# Altium schematic sheet FXAS21002C.SchDoc
size A4
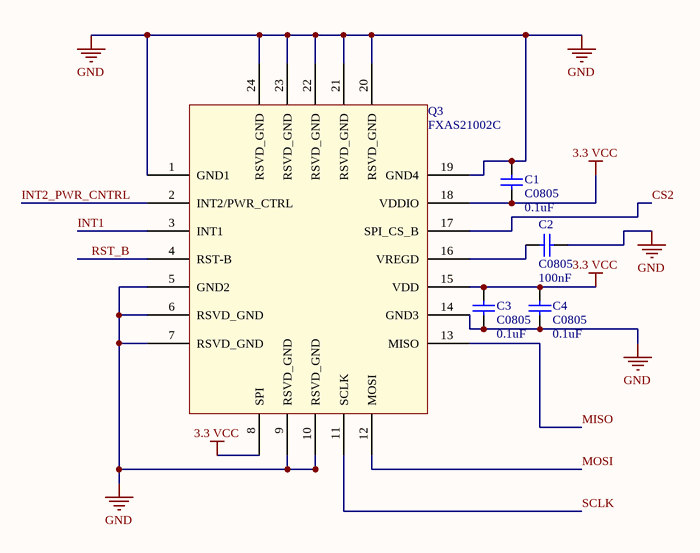
[diagram p0: FXAS21002C.SchDoc]

## Parts
C1  C0805  value 0.1uF  [0805]
C2  C0805  value 100nF  [0805]
C3  C0805  value 0.1uF  [0805]
C4  C0805  value 0.1uF  [0805]
Q3  FXAS21002C  [FXAS21002C-24QFN]

## Nets
3.3 VCC: C1.1 C3.2 C4.2 Q3.8(SPI) Q3.15(VDD) Q3.18(VDDIO)
GND: C1.2 C2.2 C3.1 C4.1 Q3.1(GND1) Q3.5(GND2) Q3.6(RSVD_GND) Q3.7(RSVD_GND) Q3.9(RSVD_GND) Q3.10(RSVD_GND) Q3.14(GND3) Q3.19(GND4) Q3.20(RSVD_GND) Q3.21(RSVD_GND) Q3.22(RSVD_GND) Q3.23(RSVD_GND) Q3.24(RSVD_GND)
CS2: Q3.17(SPI_CS_B)
INT1: Q3.3(INT1)
INT2_PWR_CNTRL: Q3.2(INT2/PWR_CTRL)
MISO: Q3.13(MISO)
MOSI: Q3.12(MOSI)
RST_B: Q3.4(RST-B)
SCLK: Q3.11(SCLK)
NetC2_1: C2.1 Q3.16(VREGD)

## Library data of the parts
C1-C4 = C0805: Ceramic Chip Capacitor - Standard; Note: Footprint corresponds to dimensions for bulk cassette packaging. This case size has tightened tolerances.; Published: 17-Jul-2002; LatestRevisionDate: 19-Mar-2004; LatestRevisionNote: Silkscreen size reduced.; DatasheetDocument: Mar-2001; PackageDocument: Mar-2001; PackageReference: 0805; Publisher: Altium Limited; Code_JEITA: 0805; Code_IPC: 2012[0805]; ComponentLink1Description: Manufacturer Link; ComponentLink1URL: http://www.kemet.com/; ComponentLink2Description: Datasheet; ComponentLink2URL: http://www.kemet.com/kemet/web/homepage/kechome.nsf/vapubfilesname/F3102TA.pdf/$file/F3102TA.pdf